# Altium schematic sheet USB2TTL.SchDoc
size A4
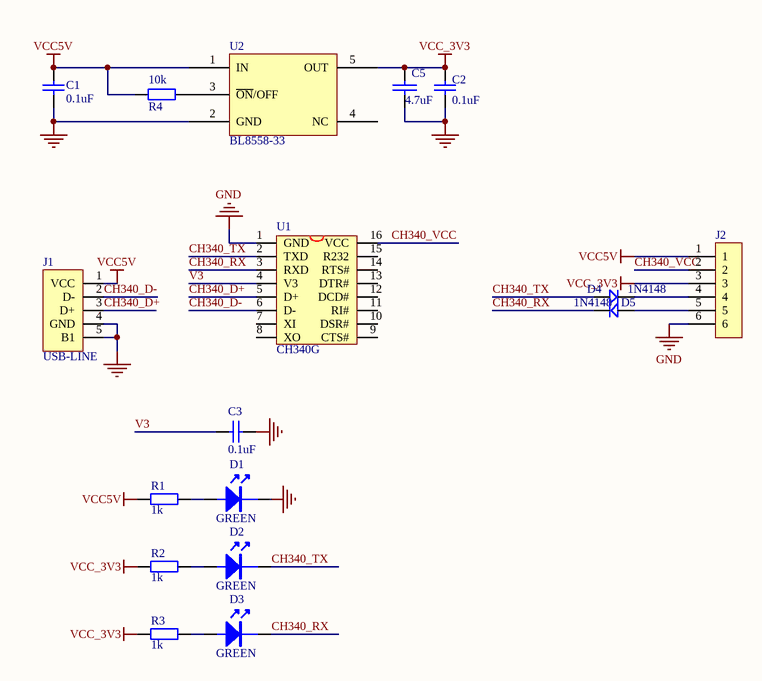
[diagram p0: USB2TTL.SchDoc]

## Parts
C1  0.1uF  [FT_0603_C]
C2  0.1uF  [FT_0603_C]
C3  0.1uF  [FT_0603_C]
C5  4.7uF  [FT_0805_C]
D1  GREEN  [FT_0603_D]
D2  GREEN  [FT_0603_D]
D3  GREEN  [FT_0603_D]
D4  1N4148  [DIODE_SOP]
D5  1N4148  [DIODE_SOP]
J1  USB-LINE  [FT_USBIF_Micro_BT_CB]
J2  CON6  [HDR1X6]  (value not drawn)
R1  1k  [FT_0603_R]
R2  1k  [FT_0603_R]
R3  1k  [FT_0603_R]
R4  10k  [FT_0603_R]
U1  CH340G  [SOP16M]
U2  BL8558-33  [FT_SOT-23-5]

## Nets
GND: C1.1 C2.1 C5.1 D1.2 J1.4(GND) J1.5(B1) J2.6 U1.1(GND) U2.2(GND)
VCC5V: C1.2 J1.1(VCC) J2.1 R1.1 R4.1 U2.1(IN)
VCC_3V3: C2.2 C5.2 J2.3 R2.1 R3.1 U2.5(OUT)
CH340_D+: J1.3(D+) U1.5(D+)
CH340_D-: J1.2(D-) U1.6(D-)
CH340_RX: D3.2 D5.2 U1.3(RXD)
CH340_TX: D2.2 D4.1 U1.2(TXD)
CH340_VCC: J2.2 U1.16(VCC)
V3: C3.2 U1.4(V3)
NetD1_1: D1.1 R1.2
NetD2_1: D2.1 R2.2
NetD3_1: D3.1 R3.2
NetD4_2: D4.2 J2.4
NetD5_1: D5.1 J2.5
NetR4_2: R4.2 U2.3(~{ON}/OFF)

Not connected (* = marked no-connect by the designer): C3 1; U1 7(XI) 8(XO) 9(CTS#) 10(DSR#) 11(RI#) 12(DCD#) 13(DTR#) 14(RTS#) 15(R232); U2 4(NC)

## Library data of the parts
C1-C3 = GR: CAP CER .1UF 16V 10% X7R 0603; Part Number: GRM188R71C104KA01D; Manufacturer: Murata Electronics North America; Supplier 1: Digi-Key; Supplier Part Number 1: 490-1532-2-ND; Manufacturer Part Number: GRM188R71C104KA01D
C5 = CAP: Capacitor
D1-D3 = LED
D4 D5 = D
R1-R4 = Resistor: RES 1.0M OHM 1/10W 5% 0603 SMD; Part Number: RC0603JR-071ML; Manufacturer: Yageo; Supplier 1: Digi-Key; Supplier Part Number 1: 311-1.0MGRDKR-ND; Manufacturer Part Number: RC0603JR-071ML
U1 = CH340G: USB2UART
U2 = LDO_5